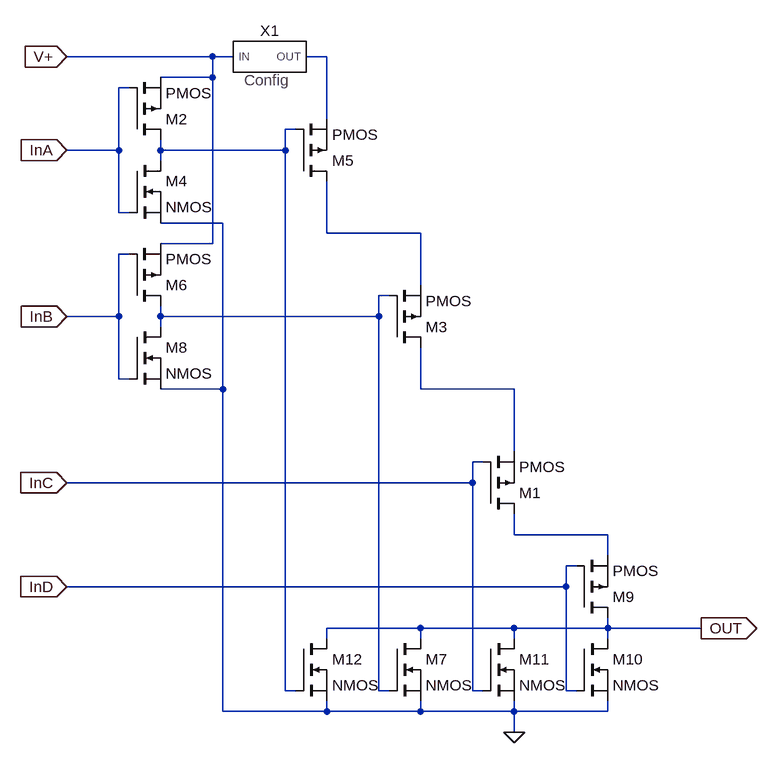
[diagram p0: schematic 4-in-LUT-1100.asc]
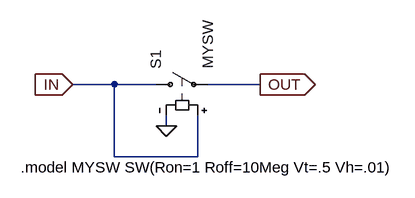
[diagram p1: sub-circuit config.asc]
4-in-LUT-1100.asc, the LTspice schematic file:
Version 4
SHEET 1 1660 728
WIRE 432 -688 208 -688
WIRE 464 -688 432 -688
WIRE 608 -688 576 -688
WIRE 432 -656 432 -688
WIRE 432 -656 352 -656
WIRE 304 -640 288 -640
WIRE 608 -592 608 -688
WIRE 560 -576 544 -576
WIRE 288 -544 288 -640
WIRE 288 -544 208 -544
WIRE 352 -544 352 -560
WIRE 544 -544 544 -576
WIRE 544 -544 352 -544
WIRE 352 -528 352 -544
WIRE 288 -448 288 -544
WIRE 304 -448 288 -448
WIRE 448 -432 352 -432
WIRE 608 -416 608 -496
WIRE 752 -416 608 -416
WIRE 432 -400 432 -656
WIRE 432 -400 352 -400
WIRE 304 -384 288 -384
WIRE 752 -336 752 -416
WIRE 704 -320 688 -320
WIRE 288 -288 288 -384
WIRE 288 -288 208 -288
WIRE 352 -288 352 -304
WIRE 688 -288 688 -320
WIRE 688 -288 352 -288
WIRE 352 -272 352 -288
WIRE 288 -192 288 -288
WIRE 304 -192 288 -192
WIRE 448 -176 448 -432
WIRE 448 -176 352 -176
WIRE 752 -176 752 -240
WIRE 896 -176 752 -176
WIRE 896 -80 896 -176
WIRE 848 -64 832 -64
WIRE 832 -32 832 -64
WIRE 832 -32 208 -32
WIRE 896 48 896 16
WIRE 1040 48 896 48
WIRE 1040 80 1040 48
WIRE 992 96 976 96
WIRE 976 128 976 96
WIRE 976 128 208 128
WIRE 752 192 608 192
WIRE 896 192 752 192
WIRE 1040 192 1040 176
WIRE 1040 192 896 192
WIRE 1184 192 1040 192
WIRE 608 208 608 192
WIRE 752 208 752 192
WIRE 896 208 896 192
WIRE 1040 208 1040 192
WIRE 544 288 544 -544
WIRE 560 288 544 288
WIRE 688 288 688 -288
WIRE 704 288 688 288
WIRE 832 288 832 -32
WIRE 848 288 832 288
WIRE 976 288 976 128
WIRE 992 288 976 288
WIRE 448 320 448 -176
WIRE 608 320 608 304
WIRE 608 320 448 320
WIRE 752 320 752 304
WIRE 752 320 608 320
WIRE 896 320 896 304
WIRE 896 320 752 320
WIRE 1040 320 1040 304
WIRE 1040 320 896 320
WIRE 896 352 896 320
FLAG 896 352 0
FLAG 1184 192 OUT
IOPIN 1184 192 Out
FLAG 208 -688 V+
IOPIN 208 -688 In
FLAG 208 -544 InA
IOPIN 208 -544 In
FLAG 208 -288 InB
IOPIN 208 -288 In
FLAG 208 -32 InC
IOPIN 208 -32 In
FLAG 208 128 InD
IOPIN 208 128 In
SYMBOL pmos 992 176 M180
SYMATTR InstName M9
SYMBOL pmos 848 16 M180
SYMATTR InstName M1
SYMBOL pmos 704 -240 M180
SYMATTR InstName M3
SYMBOL pmos 560 -496 M180
SYMATTR InstName M5
SYMBOL nmos 704 208 R0
SYMATTR InstName M7
SYMBOL nmos 992 208 R0
SYMATTR InstName M10
SYMBOL nmos 848 208 R0
SYMATTR InstName M11
SYMBOL nmos 560 208 R0
SYMATTR InstName M12
SYMBOL Config 512 -688 R0
SYMATTR InstName X1
SYMBOL pmos 304 -560 M180
SYMATTR InstName M2
SYMBOL nmos 304 -528 R0
SYMATTR InstName M4
SYMBOL pmos 304 -304 M180
SYMATTR InstName M6
SYMBOL nmos 304 -272 R0
SYMATTR InstName M8

config.asc, the sub-circuit schematic file:
Version 4
SHEET 1 880 680
WIRE 208 192 144 192
WIRE 272 192 208 192
WIRE 432 192 352 192
WIRE 288 256 288 240
WIRE 208 304 208 192
WIRE 336 304 336 240
WIRE 336 304 208 304
FLAG 432 192 OUT
IOPIN 432 192 Out
FLAG 144 192 IN
IOPIN 144 192 In
FLAG 288 256 0
SYMBOL sw 256 192 R270
SYMATTR InstName S1
SYMATTR Value MYSW
TEXT 64 320 Left 2 !.model MYSW SW(Ron=1 Roff=10Meg Vt=.5 Vh=.01)

The netlist it stands for:
* 4-in-LUT-1100.asc
M9 OUT InD N006 N006 PMOS
M1 N006 InC N005 N005 PMOS
M3 N005 N004 N003 N003 PMOS
M5 N003 N002 N001 N001 PMOS
M7 OUT N004 0 0 NMOS
M10 OUT InD 0 0 NMOS
M11 OUT InC 0 0 NMOS
M12 OUT N002 0 0 NMOS
XX1 V+ N001 config
M2 N002 InA V+ V+ PMOS
M4 N002 InA 0 0 NMOS
M6 N004 InB V+ V+ PMOS
M8 N004 InB 0 0 NMOS

* block symbol definitions
.subckt config IN OUT
S1 IN OUT IN 0 MYSW
.model MYSW SW(Ron=1 Roff=10Meg Vt=.5 Vh=.01)
.ends config

.model NMOS NMOS
.model PMOS PMOS
.lib standard.mos
.backanno
.end